# Altium schematic sheet LED.SchDoc
size A4; SheetNumber: 11; SheetTotal: 11
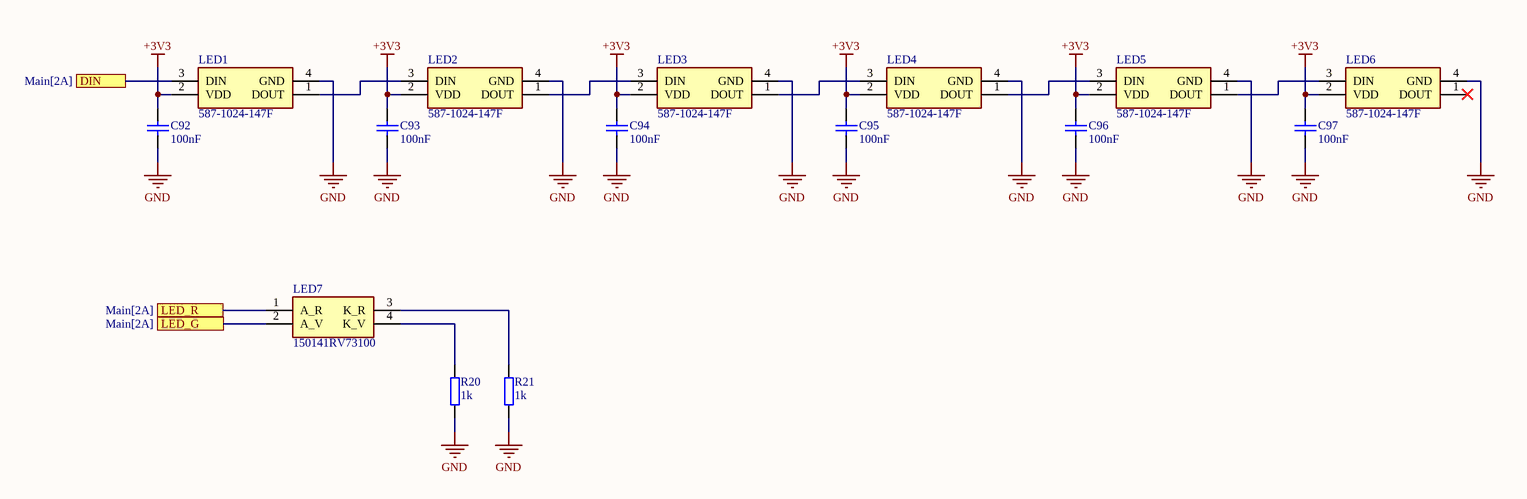
[diagram p0: LED.SchDoc]

## Parts
C92  value 100nF  [CAP0402]  (hidden comment: Cap0402)
C93  value 100nF  [CAP0402]  (hidden comment: Cap0402)
C94  value 100nF  [CAP0402]  (hidden comment: Cap0402)
C95  value 100nF  [CAP0402]  (hidden comment: Cap0402)
C96  value 100nF  [CAP0402]  (hidden comment: Cap0402)
C97  value 100nF  [CAP0402]  (hidden comment: Cap0402)
LED1  587-1024-147F  [5871024147F]
LED2  587-1024-147F  [5871024147F]
LED3  587-1024-147F  [5871024147F]
LED4  587-1024-147F  [5871024147F]
LED5  587-1024-147F  [5871024147F]
LED6  587-1024-147F  [5871024147F]
LED7  150141RV73100  [150141RV73100]
R20  value 1k  [RES0402]  (hidden comment: Res0402)
R21  value 1k  [RES0402]  (hidden comment: Res0402)

## Ports
DIN (see Main[2A]), LED_G (see Main[2A]), LED_R (see Main[2A])

## Nets
+3V3: C92.2 C93.2 C94.2 C95.2 C96.2 C97.2 LED1.2(VDD) LED2.2(VDD) LED3.2(VDD) LED4.2(VDD) LED5.2(VDD) LED6.2(VDD)
GND: C92.1 C93.1 C94.1 C95.1 C96.1 C97.1 LED1.4(GND) LED2.4(GND) LED3.4(GND) LED4.4(GND) LED5.4(GND) LED6.4(GND) R20.1 R21.1
DIN: LED1.3(DIN) ; port DIN
LED_G: LED7.2(A_V) ; port LED_G
LED_R: LED7.1(A_R) ; port LED_R
NetLED1_1: LED1.1(DOUT) LED2.3(DIN)
NetLED2_1: LED2.1(DOUT) LED3.3(DIN)
NetLED3_1: LED3.1(DOUT) LED4.3(DIN)
NetLED4_1: LED4.1(DOUT) LED5.3(DIN)
NetLED5_1: LED5.1(DOUT) LED6.3(DIN)
NetLED7_3: LED7.3(K_R) R21.2
NetLED7_4: LED7.4(K_V) R20.2

Not connected (* = marked no-connect by the designer): LED6 1(DOUT)*

## Library data of the parts
C92-C97 = Cap0402: Voltage: 50V
LED1-LED6 = 587-1024-147F: LED; Manufacturer_Name: Dialight; Datasheet Link: https://s3-us-west-2.amazonaws.com/catsy.557/Dialight_datasheet_587-1024-147F_Addressable_RGB.pdf; Height: 0.9mm; Manufacturer_Part_Number: 587-1024-147F
LED7 = 150141RV73100: LED (Multiple); Manufacturer_Name: Wurth Elektronik; Datasheet Link: https://www.we-online.com/components/products/datasheet/150141RV73100.pdf; Height: 2.1mm; Manufacturer_Part_Number: 150141RV73100; Mouser Part Number: 710-150141RV73100; Mouser Price/Stock: https://www.mouser.co.uk/ProductDetail/Wurth-Elektronik/150141RV73100?qs=LlUlMxKIyB1w9QlMugtMLA%3D%3D